# Altium schematic sheet 90_CAN.SchDoc
size A4; SheetNumber: 10; SheetTotal: 12
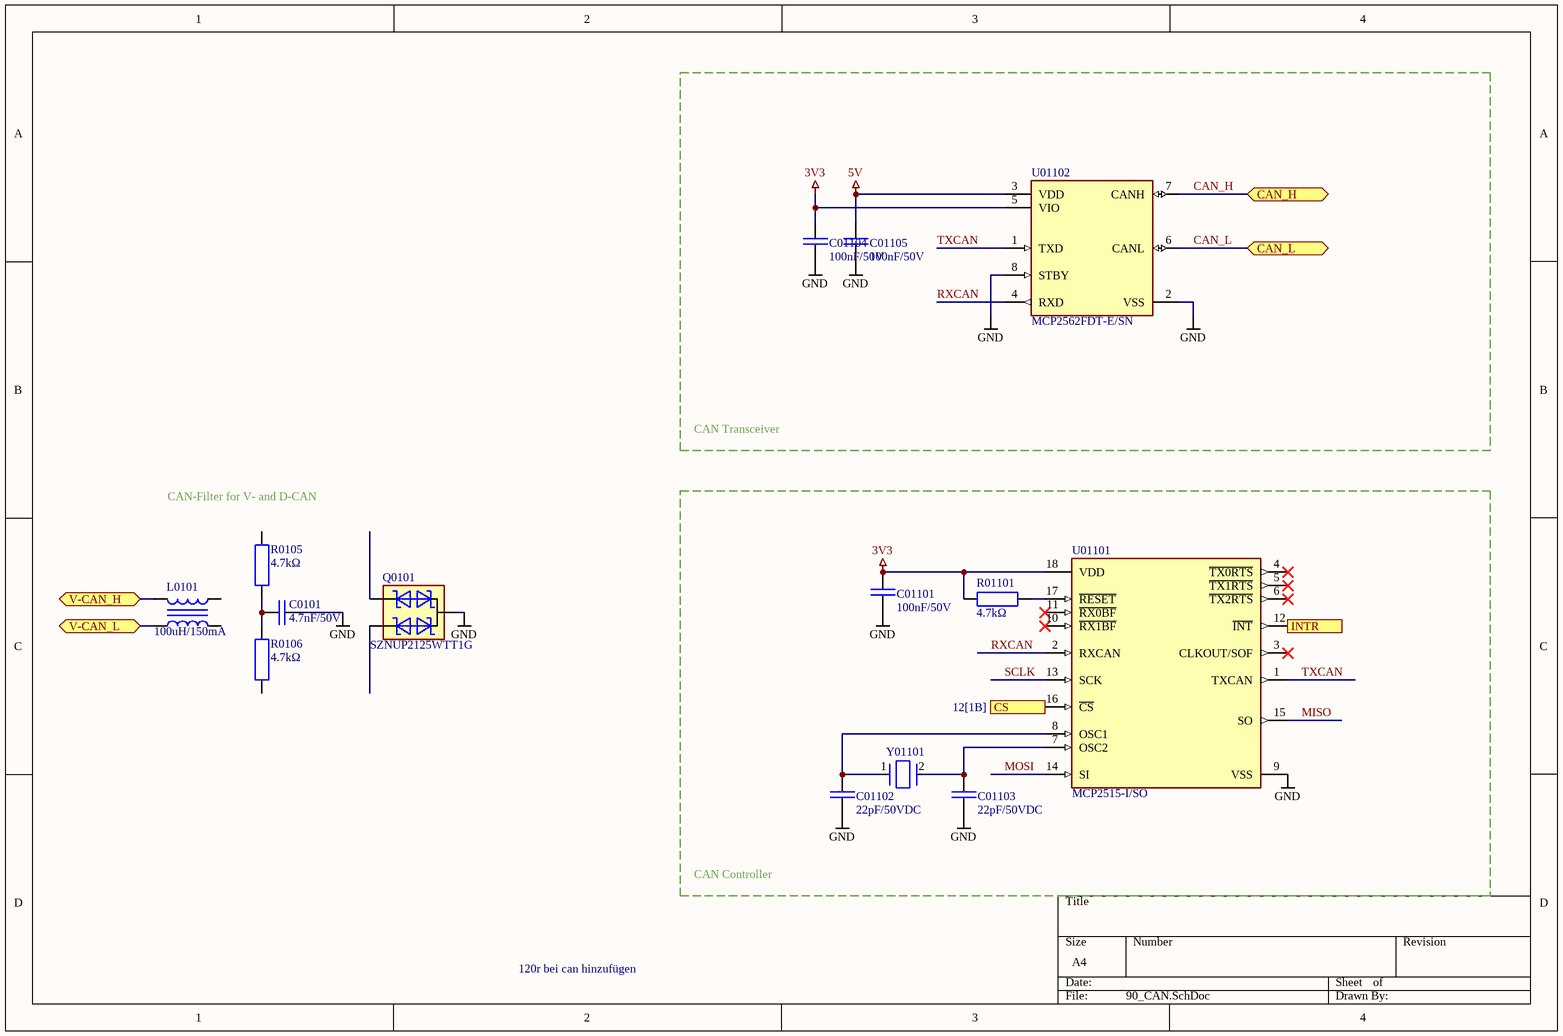
[diagram p0: 90_CAN.SchDoc]

## Parts
C0101  4.7nF/50V  [CS_EIA0603_H1.00]
C01101  100nF/50V  [CS_EIA0603_H0.90]
C01102  22pF/50VDC  [CS_EIA0603_H0.90]
C01103  22pF/50VDC  [CS_EIA0603_H0.90]
C01104  100nF/50V  [CS_EIA0603_H0.90]
C01105  100nF/50V  [CS_EIA0603_H0.90]
L0101  100uH/150mA  [ACT45B_TDK]
Q0101  SZNUP2125WTT1G  [SOT-323_ON_SEMICONDUCTOR]
R0105  4.7kΩ  [RS_EIA1206_H0.70]
R0106  4.7kΩ  [RS_EIA1206_H0.70]
R01101  4.7kΩ  [RS_EIA0603_H0.60]
U01101  MCP2515-I/SO  [FP-C04-051-MFG]
U01102  MCP2562FDT-E/SN  [FP-C04-057-SN-MFG]
Y01101  ABLS-16.000MHZ-K4T  [FP-ABLS-MFG]  (value not drawn)

## Blocks framed on the sheet
CAN Transceiver: C01104 C01105 U01102
CAN Controller: C01101 C01102 C01103 R01101 U01101 Y01101

## Ports
CAN_H (bidir), CAN_L (bidir), CS (in, see 12[1B]), INTR, V-CAN_H (bidir), V-CAN_L (bidir)

## Nets
3V3: C01101.1 C01104.1 R01101.2 U01101.18(VDD) U01102.5(VIO)
5V: C01105.1 U01102.3(VDD)
GND: C0101.2 C01101.2 C01102.1 C01103.1 C01104.2 C01105.2 Q0101.3 U01101.9(VSS) U01102.2(VSS) U01102.8(STBY)
CAN_H: U01102.7(CANH) ; port CAN_H
CAN_L: U01102.6(CANL) ; port CAN_L
CS: U01101.16(~{CS}) ; port CS
INTR: U01101.12(~{INT}) ; port INTR
MISO: U01101.15(SO)
MOSI: U01101.14(SI)
RXCAN: U01101.2(RXCAN) U01102.4(RXD)
SCLK: U01101.13(SCK)
TXCAN: U01101.1(TXCAN) U01102.1(TXD)
V-CAN_H: L0101.2 ; port V-CAN_H
V-CAN_L: L0101.1 ; port V-CAN_L
NetC0101_1: C0101.1 R0105.1 R0106.1
NetC01102_2: C01102.2 U01101.8(OSC1) Y01101.1
NetC01103_2: C01103.2 U01101.7(OSC2) Y01101.2
NetR01101_1: R01101.1 U01101.17(~{RESET})

Not connected (* = marked no-connect by the designer): L0101 3 4; Q0101 1 2; R0105 2; R0106 2; U01101 3(CLKOUT/SOF)* 4(~{TX0RTS})* 5(~{TX1RTS})* 6(~{TX2RTS})* 10(~{RX1BF})* 11(~{RX0BF})*

## Notes on the sheet
- (near R0105) CAN-Filter for V- and D-CAN
- 120r bei can hinzufügen

## Library data of the parts
C0101 = 2132: Part Number: 2132; Manufacturer Part Number: C0603C472K5RACAUTO; Part Number Inovance: 05025154; LibCare Control and Release: eha, 06.02.2019; LibCare Create: dz, 09.10.2018; Text Field1: 10747; AAA-Component Name: CS_0603_4N7/50VDC/X7R/10%/Q_KEMET; Component Category: Capacitor; HelpURL: d3:P000037793; Comment Text: 4.7nF/50V
C01101 C01104 C01105 = 4686: Part Number: 4686; Manufacturer Part Number: AC0603KRX7R9BB104; Manufacturer: YAGEO; Part Number Inovance: 05025071; LibCare Control and Release: pr, 27.10.2021; LibCare Create: ct, 31.08.2021; Text Field1: 1001083; AAA-Component Name: CS_0603_100N/50V/X7R/10%/Q2_AC0603KRX7R9BB104_YAGEO; Component Category: Capacitor; HelpURL: d3:P000478103; Comment Text: 100nF/50V
C01102 C01103 = 3844: Part Number: 3844; Manufacturer Part Number: GCM1885C1H220JA16D; Manufacturer: MURATA; Part Number Inovance: 05025109; LibCare Control and Release: jsv01, 06.09.2022; LibCare Create: Illya L., 16.08.2022        ,ema11; Text Field1: 23395; AAA-Component Name: CS_0603_22P/5%/Q1_GCM-SERIES_TDK; Component Category: Capacitor; HelpURL: d3:P000478318; Comment Text: 22pF/50VDC
L0101 = 2761: Part Number: 2761; Manufacturer Part Number: ACT45B-101-2P-TL003; Part Number Inovance: 11030065; Component Category: Inductor; LibCare Control and Release: kp, 28.07.2020; LibCare Create: dz, 27.07.2020; Text Field1: 20939; AAA-Component Name: LS_100U/150mA_ACT45B_TDK; HelpURL: d3:P000362946; Comment Text: 100uH/150mA
Q0101 = 3643: Part Number: 3643; Part Number Inovance: 06016365; Manufacturer: ONSEMI; Component Category: Suppressor Diode; LibCare Create: pr, 22.06.2022; AAA-Component Name: ZS_SZNUP2125WTT1G_ONSEMI; Text Field1: IA; LibCare Control and Release: rde01, 15.09.2022; HelpURL: d3:P000; Manufacturer Part Number: SZNUP2125WTT1G; Comment Text: SZNUP2125WTT1G
R0105 R0106 = AC1206FR-074K7L: SMD 4.7 kOhms 250 mW 1206 1%; Part Number Inovance: 04027487; Manufacturer: YAGEO; AAA-Component Name: RS_1206_4.7K/1%/Q_AC_YAGEO; LibCare Control and Release: rde01, 15.09.2022; Text Field1: IA; Comment Text: 4.7kΩ; Manufacturer Part Number: AC1206FR-074K7L
R01101 = 3222: Part Number: 3222; Manufacturer Part Number: AC0603FR-074K7L; Manufacturer: YAGEO; Part Number Inovance: 04027354; LibCare Control and Release: pr, 02.11.2021; LibCare Create: ct, 02.09.2021; Text Field1: 23321; AAA-Component Name: RS_0603_4K7/1%/Q2_AC-SERIES_YAGEO; Component Category: Resistor; HelpURL: d3:P000477738; Comment Text: 4.7kΩ
U01101 = CMP-0186-00133-3: IC CAN CONTROLLER W/SPI 18SOIC; Manufacturer: Microchip; Min Supply Voltage: 2.7V; Max Supply Voltage: 5.5V; Standoff Height: 0.1mm; Nominal Supply Current: 10mA; Interface: SPI,CAN; Lead Free: Yes; Digikey Description: IC CAN CONTROLLER W/SPI 18SOIC; Category: IC; RoHS: TRUE; Manufacturer Part Number: MCP2515-I/SO; ComponentLink2URL: http://ww1.microchip.com/downloads/en/DeviceDoc/MCP2515-Stand-Alone-CAN-Controller-with-SPI-20001801J.pdf; Mouser Description: CAN Interface IC W/ SPI Interface; Device Class L2: Interface ICs; Package: C04-051; Automotive: No; Function: Controller; Octopart: https://octopart.com/mcp2515-i%2Fso-microchip-430187; Temperature: -40°C to +85°C; Ipc Land Pattern Name: SOIC127P1030X265-18; Ambient Temperature Range Low: -65°C; Height: 2.65mm; Device Class L1: Integrated Circuits (ICs); Ambient Temperature Range High: +125°C; Footprint Url: http://ww1.microchip.com/downloads/en/DeviceDoc/18L_SOIC_Wide_7.50_SO_C04-0051D.pdf; Temperature Range Low: -40°C; Device Class L3: Controllers; Temperature Range High: +85°C; ComponentLink2Description: Datasheet
U01102 = CMP-06279-000005-1: IC TRANSCEIVER 1/1 8SOIC; Operating Supply Current: 70mA; Data Rate: 8Mbps; Number of Transceivers: 1; Receiver Hysteresis: 200mV; Max Supply Voltage: 5.5V; Min Supply Voltage: 4.5V; Weight: 0.019048oz; Package Quantity: 3300; Case/Package: SOIC; Mount: Surface Mount; Max Operating Temperature: 125°C; Min Operating Temperature: -40°C; Packaging: Tape and Reel; Number of Pins: 8
Y01101 = CMP-27762-000003-1: CRYSTAL 16.0000MHZ 18PF SMD; Manufacturer: Abracon; Frequency: 16MHz; Stability: 50ppm; Tolerance: 30ppm; Standoff Height: 0mm; Esr: 40Ω; ComponentLink2URL: https://abracon.com/Resonators/abls.pdf; Temperature Range High: +125°C; Package: ABLS; Device Class L3: Crystals; Temperature: -40°C to +125°C; Load Capacitance: 18pF; Device Class L2: Crystals / Oscillators; Mouser Description: Crystal 16MHz ±30ppm (Tol) ±50ppm (Stability) 18pF FUND 40Ohm 2-Pin HC-49/US SMD T/R; Category: Crys; ComponentLink2Description: Datasheet; Manufacturer Part Number: ABLS-16.000MHZ-K4T; Series: ABLS; Automotive: No; Octopart: https://octopart.com/abls-16.000mhz-k4t-abracon-18618626; RoHS: TRUE; Digikey Description: CRYSTAL 16.0000MHZ 18PF SMD; Temperature Range Low: -40°C; Lead Free: Yes; Height: 4.3mm; Device Class L1: Passive Components